# Altium schematic sheet Main.SchDoc: SR4K_PHY6222
size A4; DrawnBy: emmovo@outlook.com; Revision: V1.2; SheetNumber: 1; SheetTotal: 5
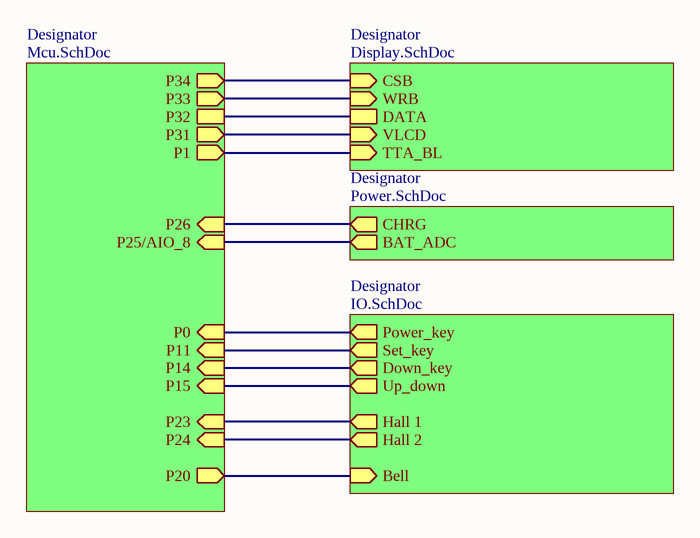
[diagram p0: Main.SchDoc]

## Sub-sheets
Designator = Display.SchDoc: CSB (in), WRB (in), DATA, VLCD (in), TTA_BL (in)
Designator = Power.SchDoc: CHRG (out), BAT_ADC (out)
Designator = IO.SchDoc: Power_key (out), Set_key (out), Down_key (out), Up_down (out), Hall 1 (out), Hall 2 (out), Bell (in)
Designator = Mcu.SchDoc: P34 (out), P33 (out), P32, P31 (out), P26 (in), P25/AIO_8 (in), P24 (in), P23 (in), P0 (in), P11 (in), P14 (in), P15 (in), P20 (out), P1 (out)

## Nets
(unnamed): sheet Designator/CSB, sheet Designator/P34
(unnamed): sheet Designator/WRB, sheet Designator/P33
(unnamed): sheet Designator/DATA, sheet Designator/P32
(unnamed): sheet Designator/VLCD, sheet Designator/P31
(unnamed): sheet Designator/TTA_BL, sheet Designator/P1
(unnamed): sheet Designator/CHRG, sheet Designator/P26
(unnamed): sheet Designator/BAT_ADC, sheet Designator/P25/AIO_8
(unnamed): sheet Designator/Power_key, sheet Designator/P0
(unnamed): sheet Designator/Set_key, sheet Designator/P11
(unnamed): sheet Designator/Down_key, sheet Designator/P14
(unnamed): sheet Designator/Up_down, sheet Designator/P15
(unnamed): sheet Designator/Hall 1, sheet Designator/P23
(unnamed): sheet Designator/Hall 2, sheet Designator/P24
(unnamed): sheet Designator/Bell, sheet Designator/P20

## Notes on the sheet
- Title
- Size:
- Date:
- A4
- Number:
- Time:
- Revision:
- Sheet
- emmovo@outlook.com
- of
- File: